# Altium schematic sheet AK5374.SchDoc: nRF2789_Dual_Wireless_Mic_RX
size A4; DrawnBy: ANOL; Revision: 1.0
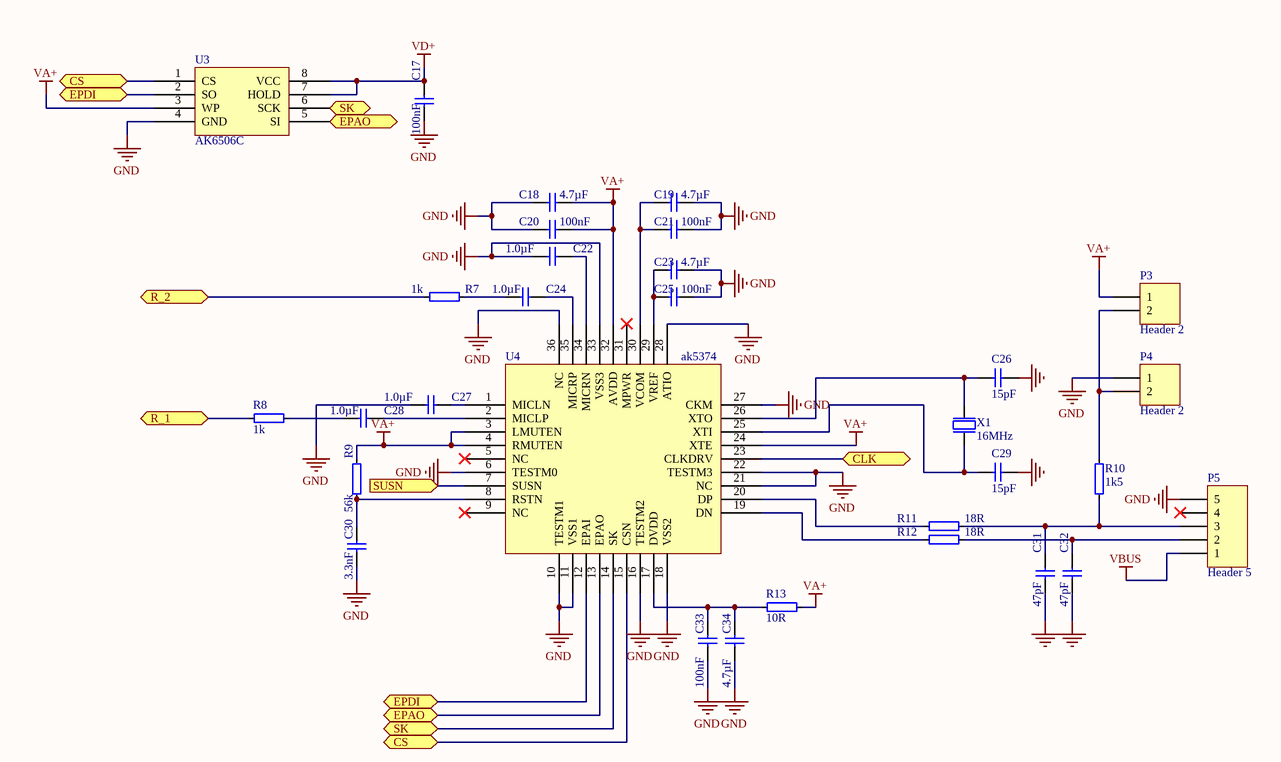
[diagram p0: AK5374.SchDoc]

## Parts
C17  100nF  [0402s]
C18  4.7µF  [0603s]
C19  4.7µF  [0603s]
C20  100nF  [0402s]
C21  100nF  [0402s]
C22  1.0µF  [0402s]
C23  4.7µF  [0603s]
C24  1.0µF  [0402s]
C25  100nF  [0402s]
C26  15pF  [0402s]
C27  1.0µF  [0402s]
C28  1.0µF  [0402s]
C29  15pF  [0402s]
C30  3.3nF  [0402s]
C31  47pF  [0402s]
C32  47pF  [0402s]
C33  100nF  [0402s]
C34  4.7µF  [0603s]
P3  Header 2  [HDR1X2]
P4  Header 2  [HDR1X2]
P5  Header 5  [Mini USB-B]
R7  1k  [0402s]
R8  1k  [0402s]
R9  56k  [0402s]
R10  1k5  [0402s]
R11  18R  [0402s]
R12  18R  [0402s]
R13  10R  [0402s]
U3  AK6506C  [TSOP65P400X95-8N]
U4  ak5374  [QFN40P500X500X80-36N]
X1  16MHz  [BT-XTAL_3225]

## Ports
CLK, CS, EPAO, EPDI, R_1, R_2, SK, SUSN (in)

## Nets
GND: C17.1 C18.2 C19.1 C20.2 C21.1 C22.1 C23.1 C25.1 C26.1 C27.1 C29.1 C30.1 C31.2 C32.2 C33.1 C34.1 P4.1 P5.5 U3.4(GND) U4.6(TESTM0) U4.10(TESTM1) U4.11(VSS1) U4.16(TESTM2) U4.18(VSS2) U4.21(NC) U4.22(TESTM3) U4.27(CKM) U4.28(ATIO) U4.33(VSS3) U4.36(NC) X1.2(GND) X1.4(GND)
VA+: C18.1 C20.1 P3.1 R9.2 R13.2 U3.3(WP) U4.3(LMUTEN) U4.4(RMUTEN) U4.24(XTE) U4.32(AVDD)
VBUS: P5.1
VD+: C17.2 U3.7(HOLD) U3.8(VCC)
CLK: U4.23(CLKDRV) ; port CLK
CS: U3.1(CS) U4.15(CSN) ; port CS
EPAO: U3.5(SI) U4.13(EPAO) ; port EPAO
EPDI: U3.2(SO) U4.12(EPAI) ; port EPDI
R_1: R8.2 ; port R_1
R_2: R7.2 ; port R_2
SK: U3.6(SCK) U4.14(SK) ; port SK
SUSN: U4.7(SUSN) ; port SUSN
NetC19_2: C19.2 C21.2 U4.30(VCOM)
NetC22_2: C22.2 U4.34(MICRN)
NetC23_2: C23.2 C25.2 U4.29(VREF)
NetC24_1: C24.1 R7.1
NetC24_2: C24.2 U4.35(MICRP)
NetC26_2: C26.2 U4.26(XTO) X1.1(inp)
NetC27_2: C27.2 U4.1(MICLN)
NetC28_1: C28.1 R8.1
NetC28_2: C28.2 U4.2(MICLP)
NetC29_2: C29.2 U4.25(XTI) X1.3(out)
NetC30_2: C30.2 R9.1 U4.8(RSTN)
NetC31_1: C31.1 P5.3 R10.1 R11.2
NetC32_1: C32.1 P5.2 R12.2
NetC33_2: C33.2 C34.2 R13.1 U4.17(DVDD)
NetP3_2: P3.2 P4.2 R10.2
NetR11_1: R11.1 U4.20(DP)
NetR12_1: R12.1 U4.19(DN)

Not connected (* = marked no-connect by the designer): P5 4*; U4 5(NC)* 9(NC)* 31(MPWR)*

## Library data of the parts
C17 C20 C21 C25 C33 = C0402-100n: Chip Cap 0402; Note: Chip Cap 10%; Artikkelnr Noca: 20039200; Part Number: C0402-100n; Manufacturer: *; Manufacturer Part Number: *; Datasheet: *; LatestRevisionDate: 2009-11-23; Pin Count: 2; Publisher: Nordic Semiconductor; Published: 2009-05-08; Value: 100nF; Supplier: *; Supplier part number: *; 2nd source Supplier: *; 2nd source part number: *
C18 C19 C23 C34 = C0603-4µ7: Chip Cap 0603; Note: Chip Cap 10%; Artikkelnr Noca: 20069060; Part Number: C0603-4µ7; Manufacturer: *; Manufacturer Part Number: *; Datasheet: *; LatestRevisionDate: 2009-11-23; Pin Count: 2; Publisher: Nordic Semiconductor; Published: 2009-05-08; Value: 4.7µF; Supplier: *; Supplier part number: *; 2nd source Supplier: *; 2nd source part number: *
C22 C24 C27 C28 = C0402-1µ0: Chip Cap 0402; Note: Chip Cap 1%; Artikkelnr Noca: 20039235; Part Number: C0402-1µ0; Manufacturer: *; Manufacturer Part Number: *; Datasheet: *; LatestRevisionDate: 2009-11-23; Pin Count: 2; Publisher: Nordic Semiconductor; Published: 2009-05-08; Value: 1.0µF; Supplier: *; Supplier part number: *; 2nd source Supplier: *; 2nd source part number: *
C26 C29 = C0402-15p: Chip Cap 0402; Note: Chip Cap 5%; Artikkelnr Noca: 20029141; Published: 2009-05-08; Publisher: Nordic Semiconductor; Value: 15pF; Part Number: C0402-15p; Manufacturer: *; Manufacturer Part Number: *; Datasheet: *; LatestRevisionDate: 2009-11-23; Pin Count: 2; Supplier: *; Supplier part number: *; 2nd source Supplier: *; 2nd source part number: *
C30 = C0402-3n3: Chip Cap 0402; Note: Chip Cap 1%; Artikkelnr Noca: N.A.; Part Number: C0402-3n3; Manufacturer: *; Manufacturer Part Number: *; Datasheet: *; LatestRevisionDate: 2009-05-08; Pin Count: 2; Publisher: Nordic Semiconductor; Published: 2009-05-08; Value: 3.3nF; Supplier: *; Supplier part number: *; 2nd source Supplier: *; 2nd source part number: *
C31 C32 = C0402-47p: Chip Cap 0402; Note: Chip Cap 1%; Artikkelnr Noca: N.A.; Part Number: C0402-47p; Manufacturer: *; Manufacturer Part Number: *; Datasheet: *; LatestRevisionDate: 2009-05-08; Pin Count: 2; Publisher: Nordic Semiconductor; Published: 2009-05-08; Value: 47pF; Supplier: *; Supplier part number: *; 2nd source Supplier: *; 2nd source part number: *
P3 P4 = Header 2: Header, 2-Pin; LatestRevisionDate: 17-Jul-2002; LatestRevisionNote: Re-released for DXP Platform.; Publisher: Altium Limited
P5 = Header 5: Header, 5-Pin; LatestRevisionDate: 17-Jul-2002; LatestRevisionNote: Re-released for DXP Platform.; Publisher: Altium Limited
R7 R8 = R0402-1k0: Chip Res 0402; Note: Chip Res 1%; Artikkelnr Noca: 27049073; Part Number: R0402-1k0; Manufacturer: *; Manufacturer Part Number: *; Datasheet: *; Footprint: 0402; LatestRevisionDate: 2009-11-23; Pin Count: 2; Publisher: Nordic Semiconductor; Published: 2009-05-08; Value: 1k; Supplier: *; Supplier part number: *; 2nd source Supplier: *; 2nd source part number: *
R9 = R0402-56k: Chip Res 0402; Note: Chip Res 1%; Artikkelnr Noca: 27049115; Part Number: R0402-56k; Manufacturer: *; Manufacturer Part Number: *; Datasheet: *; Footprint: 0402; LatestRevisionDate: 2009-11-23; Pin Count: 2; Publisher: Nordic Semiconductor; Published: 2009-05-08; Value: 56k; Supplier: *; Supplier part number: *; 2nd source Supplier: *; 2nd source part number: *
R10 = R0402-1k5: Chip Res 0402; Note: Chip Res 1%; Artikkelnr Noca: 27049077; Part Number: R0402-1k5; Manufacturer: *; Manufacturer Part Number: *; Datasheet: *; Footprint: 0402; LatestRevisionDate: 2009-11-23; Pin Count: 2; Publisher: Nordic Semiconductor; Published: 2009-05-08; Value: 1k5; Supplier: *; Supplier part number: *; 2nd source Supplier: *; 2nd source part number: *
R11 R12 = R0402-18R: Chip Res 0402; Note: Chip Res 1%; Artikkelnr Noca: 27049031; Part Number: R0402-18R; Manufacturer: *; Manufacturer Part Number: *; Datasheet: *; Footprint: 0402; LatestRevisionDate: 2009-11-23; Pin Count: 2; Publisher: Nordic Semiconductor; Published: 2009-05-08; Value: 18R; Supplier: *; Supplier part number: *; 2nd source Supplier: *; 2nd source part number: *
R13 = R0402-10R: Chip Res 0402; Note: Chip Res 1%; Artikkelnr Noca: 27049025; Part Number: R0402-10R; Manufacturer: *; Manufacturer Part Number: *; Datasheet: *; Footprint: 0402; LatestRevisionDate: 2009-11-23; Pin Count: 2; Publisher: Nordic Semiconductor; Published: 2009-05-08; Value: 10R; Supplier: *; Supplier part number: *; 2nd source Supplier: *; 2nd source part number: *
X1 = XTAL SMD 16MHz (3225): XTAL SMD 16MHz, 9pF, Mercury; Note: XTAL SMD 16MHz 3225; Artikkelnr Noca: 22019087; Part Number: XTAL SMD 16MHz (3225); Manufacturer: *; Manufacturer Part Number: *; Datasheet: http://ndap3-net.ebz.epson.co.jp/w/www/PDFS/epdoc_qd.nsf/85a4e2c523a1f89349257068002f9e30/31e98956c8f991cd4925707c003b38b1/$FILE/FA-238_238V_TSX-3225_E08X.pdf; LatestRevisionDate: 2010-02-24; Pin Count: 4; Publisher: Nordic Semiconductor; Published: 2009-05-30; Value: 16MHz; Supplier: *; Supplier part number: *; 2nd source Supplier: *; 2nd source part number: *